# EAGLE schematic L293DNE (EAGLE 6.3)
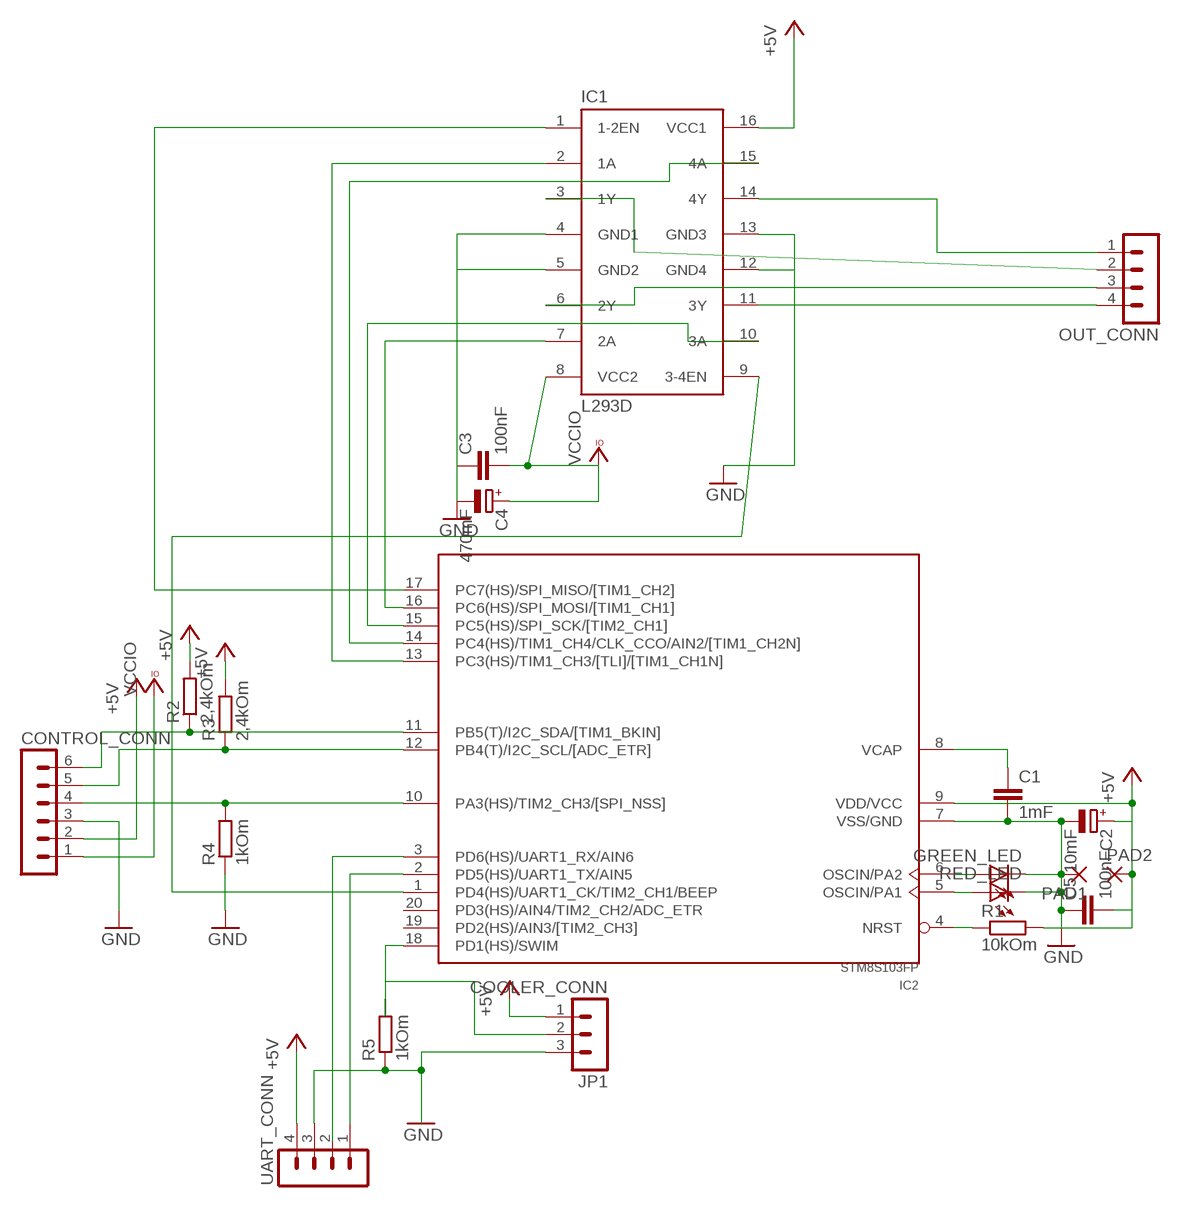
[diagram p0: schematic, sheet 1]

## Parts
C1  1mF  C-EUC0805  [C0805]
C2  10mF  CPOL-EUSMCC  [SMC_C]
C3  100nF  C-EUC1206  [C1206]
C4  470mF  CPOL-EUE2.5-5  [E2,5-5]
C5  100nF  C-EUC1206  [C1206]
CONTROL_CONN  MA06-1  [MA06-1]
GREEN_LED  LEDSML0805  [SML0805]
IC1  L293D  [DIL16]
IC2  STM8S103FP  [TSSOP20]
JP1  COOLER_CONN  MA03-1  [MA03-1]
OUT_CONN  MA04-1  [MA04-1]
PAD1  SMD2  [SMD1,27-2,54]
PAD2  SMD2  [SMD1,27-2,54]
R1  10kOm  R-EU_R0805  [R0805]
R2  2,4kOm  R-EU_R0805  [R0805]
R3  2,4kOm  R-EU_R0805  [R0805]
R4  1kOm  R-EU_R0805  [R0805]
R5  1kOm  R-EU_R0805  [R0805]
RED_LED  LEDSML0805  [SML0805]
UART_CONN  MA04-1  [MA04-1]

## Nets
+5V: C2.+ C5.2 CONTROL_CONN.2 IC1.16(VCC1) IC2.9(VDD/VCC) JP1.1 PAD2.1(P) R1.2 R2.2 R3.2 UART_CONN.4
DIR\I2C_SCL: CONTROL_CONN.5 IC2.12(PB4(T)/I2C_SCL/[ADC_ETR]) R3.1
EN: CONTROL_CONN.4 IC2.10(PA3(HS)/TIM2_CH3/[SPI_NSS]) R4.2
GND: C1.2 C2.- C3.1 C4.- C5.1 CONTROL_CONN.3 GREEN_LED.C IC1.4(GND1) IC1.5(GND2) IC1.12(GND4) IC1.13(GND3) IC2.7(VSS/GND) JP1.3 PAD1.1(P) R4.1 R5.1 RED_LED.C UART_CONN.3
N$1: IC2.18(PD1(HS)/SWIM) JP1.2 R5.2
N$2: IC1.14(4Y) OUT_CONN.1
N$3: IC1.15(4A) IC2.14(PC4(HS)/TIM1_CH4/CLK_CCO/AIN2/[TIM1_CH2N])
N$4: IC1.10(3A) IC2.15(PC5(HS)/SPI_SCK/[TIM2_CH1])
N$5: IC1.7(2A) IC2.16(PC6(HS)/SPI_MOSI/[TIM1_CH1])
N$6: IC1.2(1A) IC2.13(PC3(HS)/TIM1_CH3/[TLI]/[TIM1_CH1N])
N$7: IC1.9(3-4EN) IC2.1(PD4(HS)/UART1_CK/TIM2_CH1/BEEP)
N$8: IC1.1(1-2EN)
N$9: IC1.3(1Y) OUT_CONN.2
N$10: C1.1 IC2.8(VCAP)
N$11: IC2.4(NRST) R1.1
N$12: IC2.5(OSCIN/PA1) RED_LED.A
N$13: GREEN_LED.A IC2.6(OSCIN/PA2)
N$14: IC1.6(2Y) OUT_CONN.3
N$15: IC2.2(PD5(HS)/UART1_TX/AIN5) UART_CONN.1
N$16: IC2.3(PD6(HS)/UART1_RX/AIN6) UART_CONN.2
N$19: IC1.11(3Y) OUT_CONN.4
STEP\I2C_SDA: CONTROL_CONN.6 IC2.11(PB5(T)/I2C_SDA/[TIM1_BKIN]) R2.1
VCCIO: C3.2 C4.+ CONTROL_CONN.1 IC1.8(VCC2)
Unconnected: IC2.17(PC7(HS)/SPI_MISO/[TIM1_CH2]) IC2.19(PD2(HS)/AIN3/[TIM2_CH3]) IC2.20(PD3(HS)/AIN4/TIM2_CH2/ADC_ETR)

## Library data of the parts
C1 C3 C5 = resistor:C-EU: CAPACITOR, European symbol
C2 C4 = resistor:CPOL-EU: POLARIZED CAPACITOR, European symbol
CONTROL_CONN = con-lstb:MA06-1: PIN HEADER; OC_FARNELL: unknown; OC_NEWARK: unknown
GREEN_LED RED_LED = led:LED: LED OSRAM: - CHIPLED LG R971, LG N971, LY N971, LG Q971, LY Q971, LO R971, LY R971 LH N974, LH R974 LS Q976, LO Q976, LY Q976 LO Q996 - Hyper CHIPLED LW Q18S LB Q993, LB Q99A, LB R99A - SideLED LS A670, LO A670, LY A670, LG A670, LP A670 LB A673, LV A673, LT A673, LW A673 LH A674 LY A675 LS A676, LA A676, LO A676, LY A676, LW A676 LS A679, LY A679, LG A679 - Hyper Micro SIDELED® LS Y876, LA Y876, LO Y876, LY Y876 LT Y87S - SmartLED LW L88C, LW L88S LB L89C, LB L89S, LG L890 LS L89K, LO L89K, LY L89K LS L896, LA L896, LO L896, LY L896 - TOPLED LS T670, LO T670, LY T670, LG T670, LP T670 LSG T670, LSP T670, LSY T670, LOP T670, LYG T670 LG T671, LOG T671, LSG T671 LB T673, LV T673, LT T673, LW T673 LH T674 LS T676, LA T676, LO T676, LY T676, LB T676, LH T676, LSB T676, LW T676 LB T67C, LV T67C, LT T67C, LS T67K, LO T67K, LY T67K, LW E67C LS E67B, LA E67B, LO E67B, LY E67B, LB E67C, LV E67C, LT E67C LW T67C LS T679, LY T679, LG T679 LS T770, LO T770, LY T770, LG T770, LP T770 LB T773, LV T773, LT T773, LW T773 LH T774 LS E675, LA E675, LY E675, LS T675 LS T776, LA T776, LO T776, LY T776, LB T776 LHGB T686 LT T68C, LB T68C - Hyper Mini TOPLED® LB M676 - Mini TOPLED Santana® LG M470 LS M47K, LO M47K, LY M47K Source: http://www.osram.convergy.de LUXEON: - LUMILED® LXK2-PW12-R00, LXK2-PW12-S00, LXK2-PW14-U00, LXK2-PW14-V00 LXK2-PM12-R00, LXK2-PM12-S00, LXK2-PM14-U00 LXK2-PE12-Q00, LXK2-PE12-R00, LXK2-PE12-S00, LXK2-PE14-T00, LXK2-PE14-U00 LXK2-PB12-K00, LXK2-PB12-L00, LXK2-PB12-M00, LXK2-PB14-N00, LXK2-PB14-P00, LXK2-PB14-Q00 LXK2-PR12-L00, LXK2-PR12-M00, LXK2-PR14-Q00, LXK2-PR14-R00 LXK2-PD12-Q00, LXK2-PD12-R00, LXK2-PD12-S00 LXK2-PH12-R00, LXK2-PH12-S00 LXK2-PL12-P00, LXK2-PL12-Q00, LXK2-PL12-R00 Source: www.luxeon.com KINGBRIGHT: KA-3528ASYC Source: www.kingbright.com
IC1 = st-microelectronics:L293D: PUSH-PULL 4 CHANNEL DRIVER; MPN: L293D; OC_FARNELL: 9589619; OC_NEWARK: 56P8249
IC2 = STM8S103:STM8S103F*: STM8S103F*
JP1 = con-lstb:MA03-1: PIN HEADER; OC_FARNELL: unknown; OC_NEWARK: unknown
OUT_CONN UART_CONN = con-lstb:MA04-1: PIN HEADER; OC_FARNELL: unknown; OC_NEWARK: unknown
PAD1 PAD2 = wirepad:SMD2: SMD PAD
R1-R5 = resistor:R-EU_: RESISTOR, European symbol